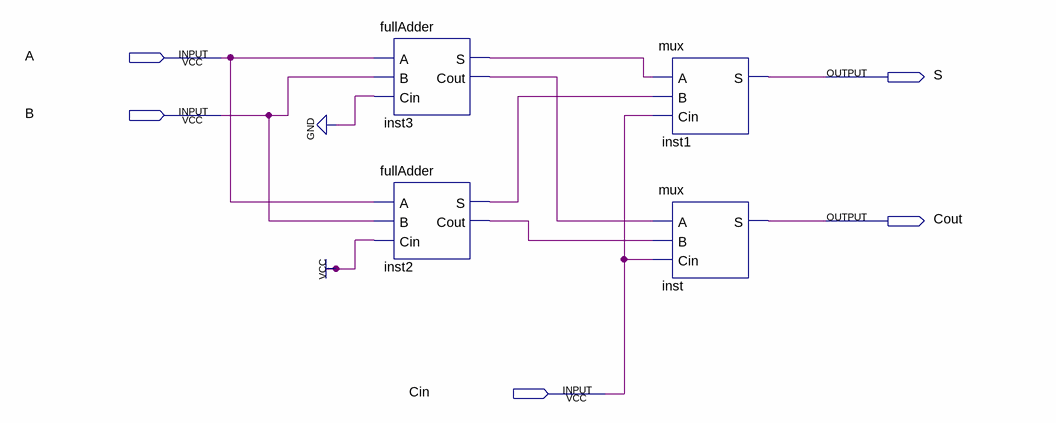
[diagram p0: schematic sheet]
// Quartus schematic 1bitCSA.bdf as structural Verilog: 4 symbols, 5 pins
module \1bitCSA  (
  input  A,
  input  B,
  input  Cin,
  output S,
  output Cout
);

  wire inst2_cout, inst2_s, inst3_cout, inst3_s;

  fullAdder inst3 (.A(A), .B(B), .Cin(1'b0), .S(inst3_s), .Cout(inst3_cout));
  fullAdder inst2 (.A(A), .B(B), .Cin(1'b1), .S(inst2_s), .Cout(inst2_cout));
  mux inst1 (.A(inst3_s), .B(inst2_s), .Cin(Cin), .S(S));
  mux inst (.A(inst3_cout), .B(inst2_cout), .Cin(Cin), .S(Cout));
endmodule
